# EAGLE design Stpr_driver_PCB (EAGLE 9.2.1)
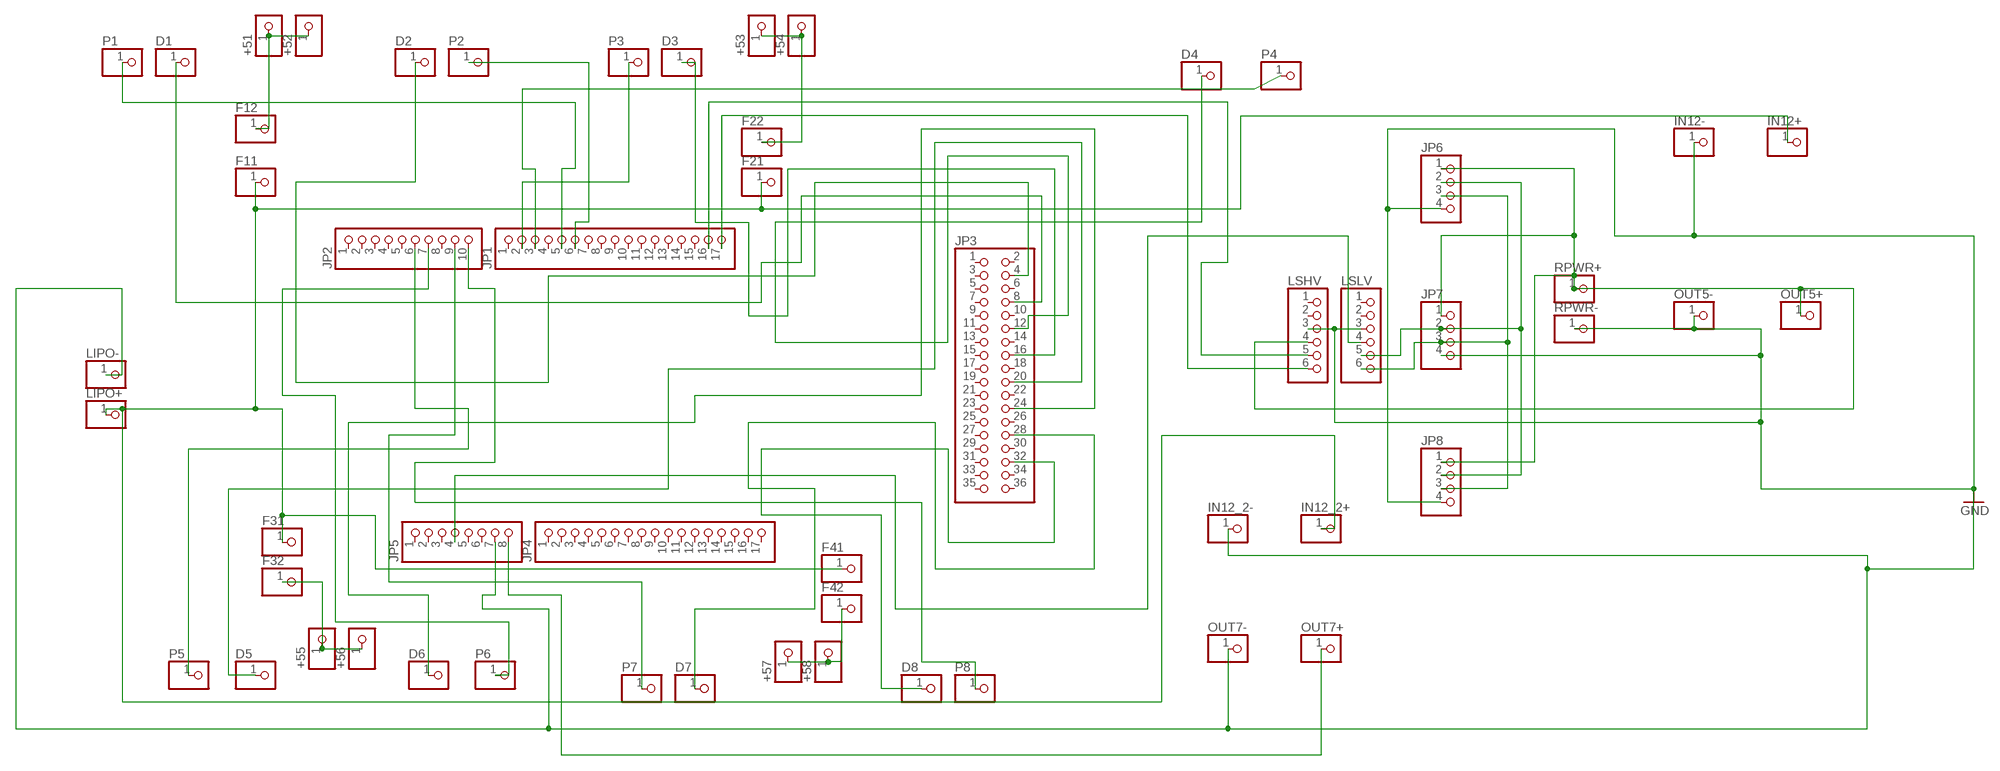
[diagram p0: schematic, sheet 1]

## Parts
+51  PINHD-1X1  [1X01]
+52  PINHD-1X1  [1X01]
+53  PINHD-1X1  [1X01]
+54  PINHD-1X1  [1X01]
+55  PINHD-1X1  [1X01]
+56  PINHD-1X1  [1X01]
+57  PINHD-1X1  [1X01]
+58  PINHD-1X1  [1X01]
D1  PINHD-1X1  [1X01]
D2  PINHD-1X1  [1X01]
D3  PINHD-1X1  [1X01]
D4  PINHD-1X1  [1X01]
D5  PINHD-1X1  [1X01]
D6  PINHD-1X1  [1X01]
D7  PINHD-1X1  [1X01]
D8  PINHD-1X1  [1X01]
F11  PINHD-1X1  [1X01]
F12  PINHD-1X1  [1X01]
F21  PINHD-1X1  [1X01]
F22  PINHD-1X1  [1X01]
F31  PINHD-1X1  [1X01]
F32  PINHD-1X1  [1X01]
F41  PINHD-1X1  [1X01]
F42  PINHD-1X1  [1X01]
IN12+  PINHD-1X1  [1X01]
IN12-  PINHD-1X1  [1X01]
IN12_2+  PINHD-1X1  [1X01]
IN12_2-  PINHD-1X1  [1X01]
JP1  PINHD-1X17  [1X17]
JP2  PINHD-1X10  [1X10]
JP3  PINHD-2X18  [2X18]
JP4  PINHD-1X17  [1X17]
JP5  PINHD-1X8  [1X08]
JP6  PINHD-1X4  [1X04]
JP7  PINHD-1X4  [1X04]
JP8  PINHD-1X4  [1X04]
LIPO+  PINHD-1X1  [1X01]
LIPO-  PINHD-1X1  [1X01]
LSHV  PINHD-1X6  [1X06]
LSLV  PINHD-1X6  [1X06]
OUT5+  PINHD-1X1  [1X01]
OUT5-  PINHD-1X1  [1X01]
OUT7+  PINHD-1X1  [1X01]
OUT7-  PINHD-1X1  [1X01]
P1  PINHD-1X1  [1X01]
P2  PINHD-1X1  [1X01]
P3  PINHD-1X1  [1X01]
P4  PINHD-1X1  [1X01]
P5  PINHD-1X1  [1X01]
P6  PINHD-1X1  [1X01]
P7  PINHD-1X1  [1X01]
P8  PINHD-1X1  [1X01]
RPWR+  PINHD-1X1  [1X01]
RPWR-  PINHD-1X1  [1X01]

## Nets
GND: IN12-.1 IN12_2-.1 JP5.7 JP6.4 JP7.4 JP8.4 LIPO-.1 LSHV.3 LSLV.3 OUT5-.1 OUT7-.1 RPWR-.1
N$1: F11.1 F21.1 F31.1 F41.1 IN12+.1 LIPO+.1
N$2: +55.1 +56.1 F32.1
N$3: +57.1 +58.1 F42.1
N$4: +51.1 +52.1 F12.1
N$5: +53.1 +54.1 F22.1
N$6: D3.1 JP3.16
N$7: IN12_2+.1
N$8: JP1.5 P1.1
N$9: JP6.1 JP7.1 JP8.1 LSHV.4 OUT5+.1 RPWR+.1
N$10: JP1.6 P2.1
N$11: JP1.2 P3.1
N$12: JP1.3 P4.1
N$13: JP2.6 P5.1
N$14: JP6.2 JP7.2 JP8.2 LSLV.5
N$15: JP2.9 P7.1
N$16: JP5.8 OUT7+.1
N$17: D1.1 JP3.8
N$18: D2.1 JP3.4
N$20: D4.1 JP3.12
N$21: JP2.10 P8.1
N$22: D5.1 JP3.20
N$23: D6.1 JP3.24
N$24: D7.1 JP3.28
N$25: D8.1 JP3.32
N$26: JP2.7 P6.1
N$27: JP6.3 JP7.3 JP8.3 LSLV.6
N$28: JP1.17 LSHV.6
N$29: JP1.16 LSHV.5
N$31: JP5.4 LSLV.4
Unconnected: JP1.1 JP1.4 JP1.7 JP1.8 JP1.9 JP1.10 JP1.11 JP1.12 JP1.13 JP1.14 JP1.15 JP2.1 JP2.2 JP2.3 JP2.4 JP2.5 JP2.8 JP3.1 JP3.2 JP3.3 JP3.5 JP3.6 JP3.7 JP3.9 JP3.10 JP3.11 JP3.13 JP3.14 JP3.15 JP3.17 JP3.18 JP3.19 JP3.21 JP3.22 JP3.23 JP3.25 JP3.26 JP3.27 JP3.29 JP3.30 JP3.31 JP3.33 JP3.34 JP3.35 JP3.36 JP4.1 JP4.2 JP4.3 JP4.4 JP4.5 JP4.6 JP4.7 JP4.8 JP4.9 JP4.10 JP4.11 JP4.12 JP4.13 JP4.14 JP4.15 JP4.16 JP4.17 JP5.1 JP5.2 JP5.3 JP5.5 JP5.6 LSHV.1 LSHV.2 LSLV.1 LSLV.2

## Library data of the parts
+51-+58 D1-D8 F11 F12 F21 F22 F31 F32 F41 F42 IN12+ IN12- IN12_2+ IN12_2- LIPO+ LIPO- OUT5+ OUT5- OUT7+ OUT7- P1-P8 RPWR+ RPWR- = pinhead:PINHD-1X1: PIN HEADER
JP1 JP4 = pinhead:PINHD-1X17: PIN HEADER
JP2 = pinhead:PINHD-1X10: PIN HEADER
JP3 = pinhead:PINHD-2X18: PIN HEADER
JP5 = pinhead:PINHD-1X8: PIN HEADER
JP6-JP8 = pinhead:PINHD-1X4: PIN HEADER
LSHV LSLV = pinhead:PINHD-1X6: PIN HEADER

## Board
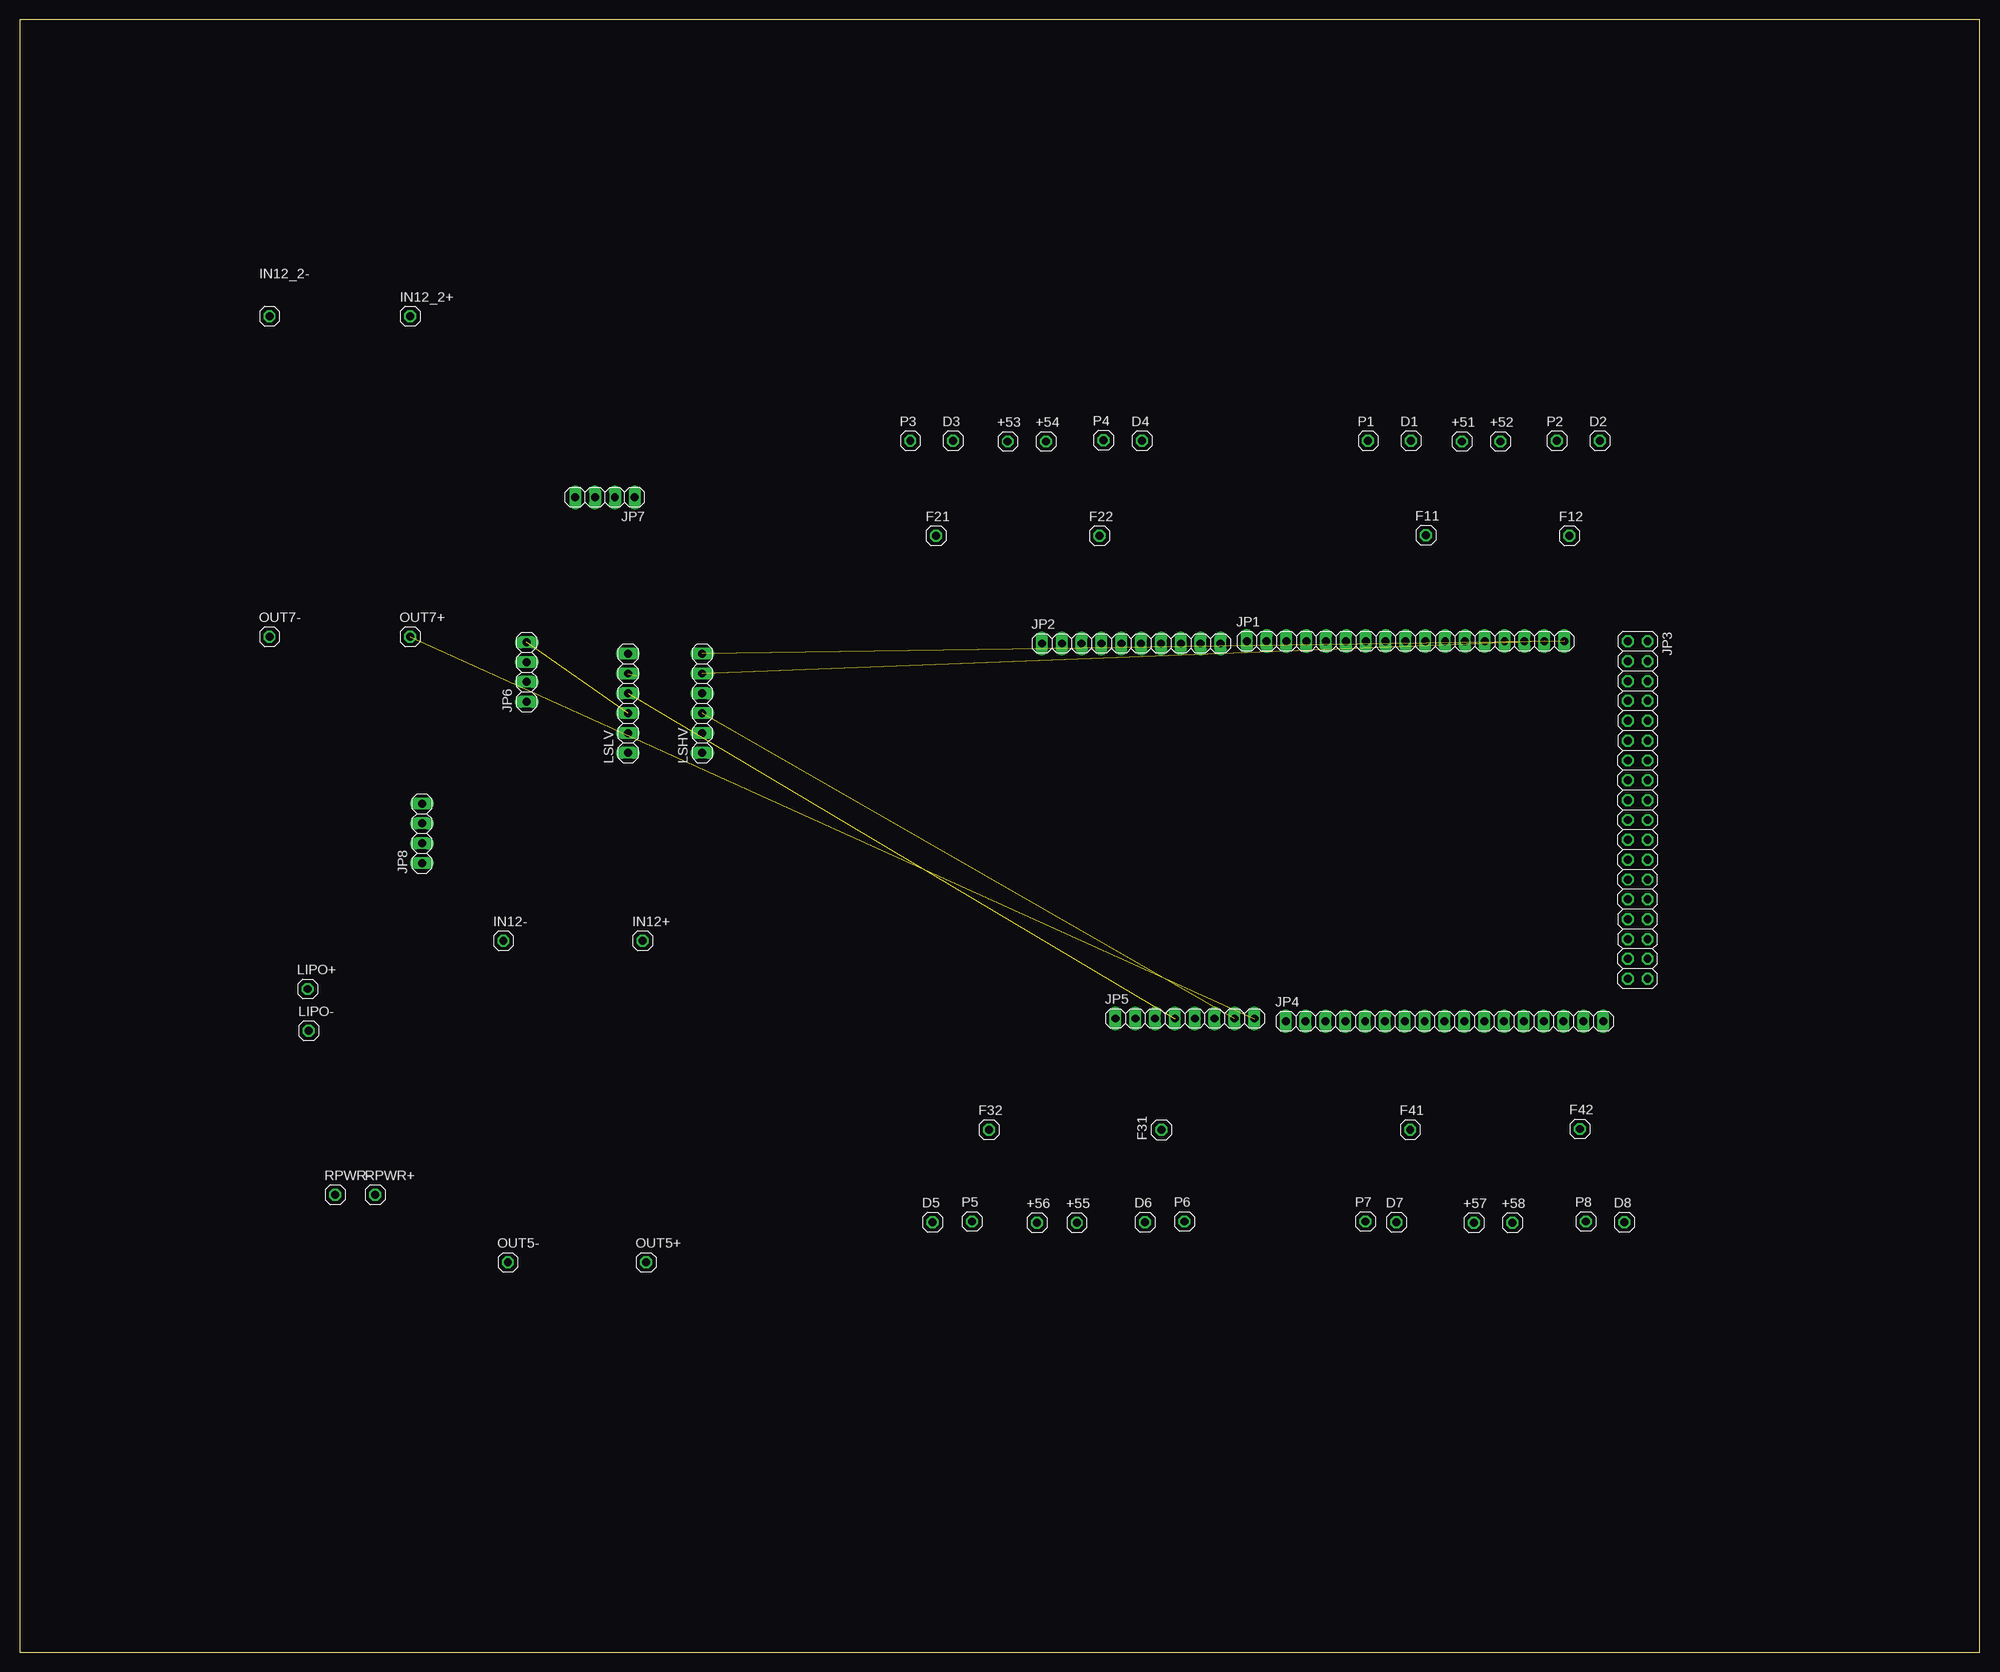
[diagram p1: board, top side]
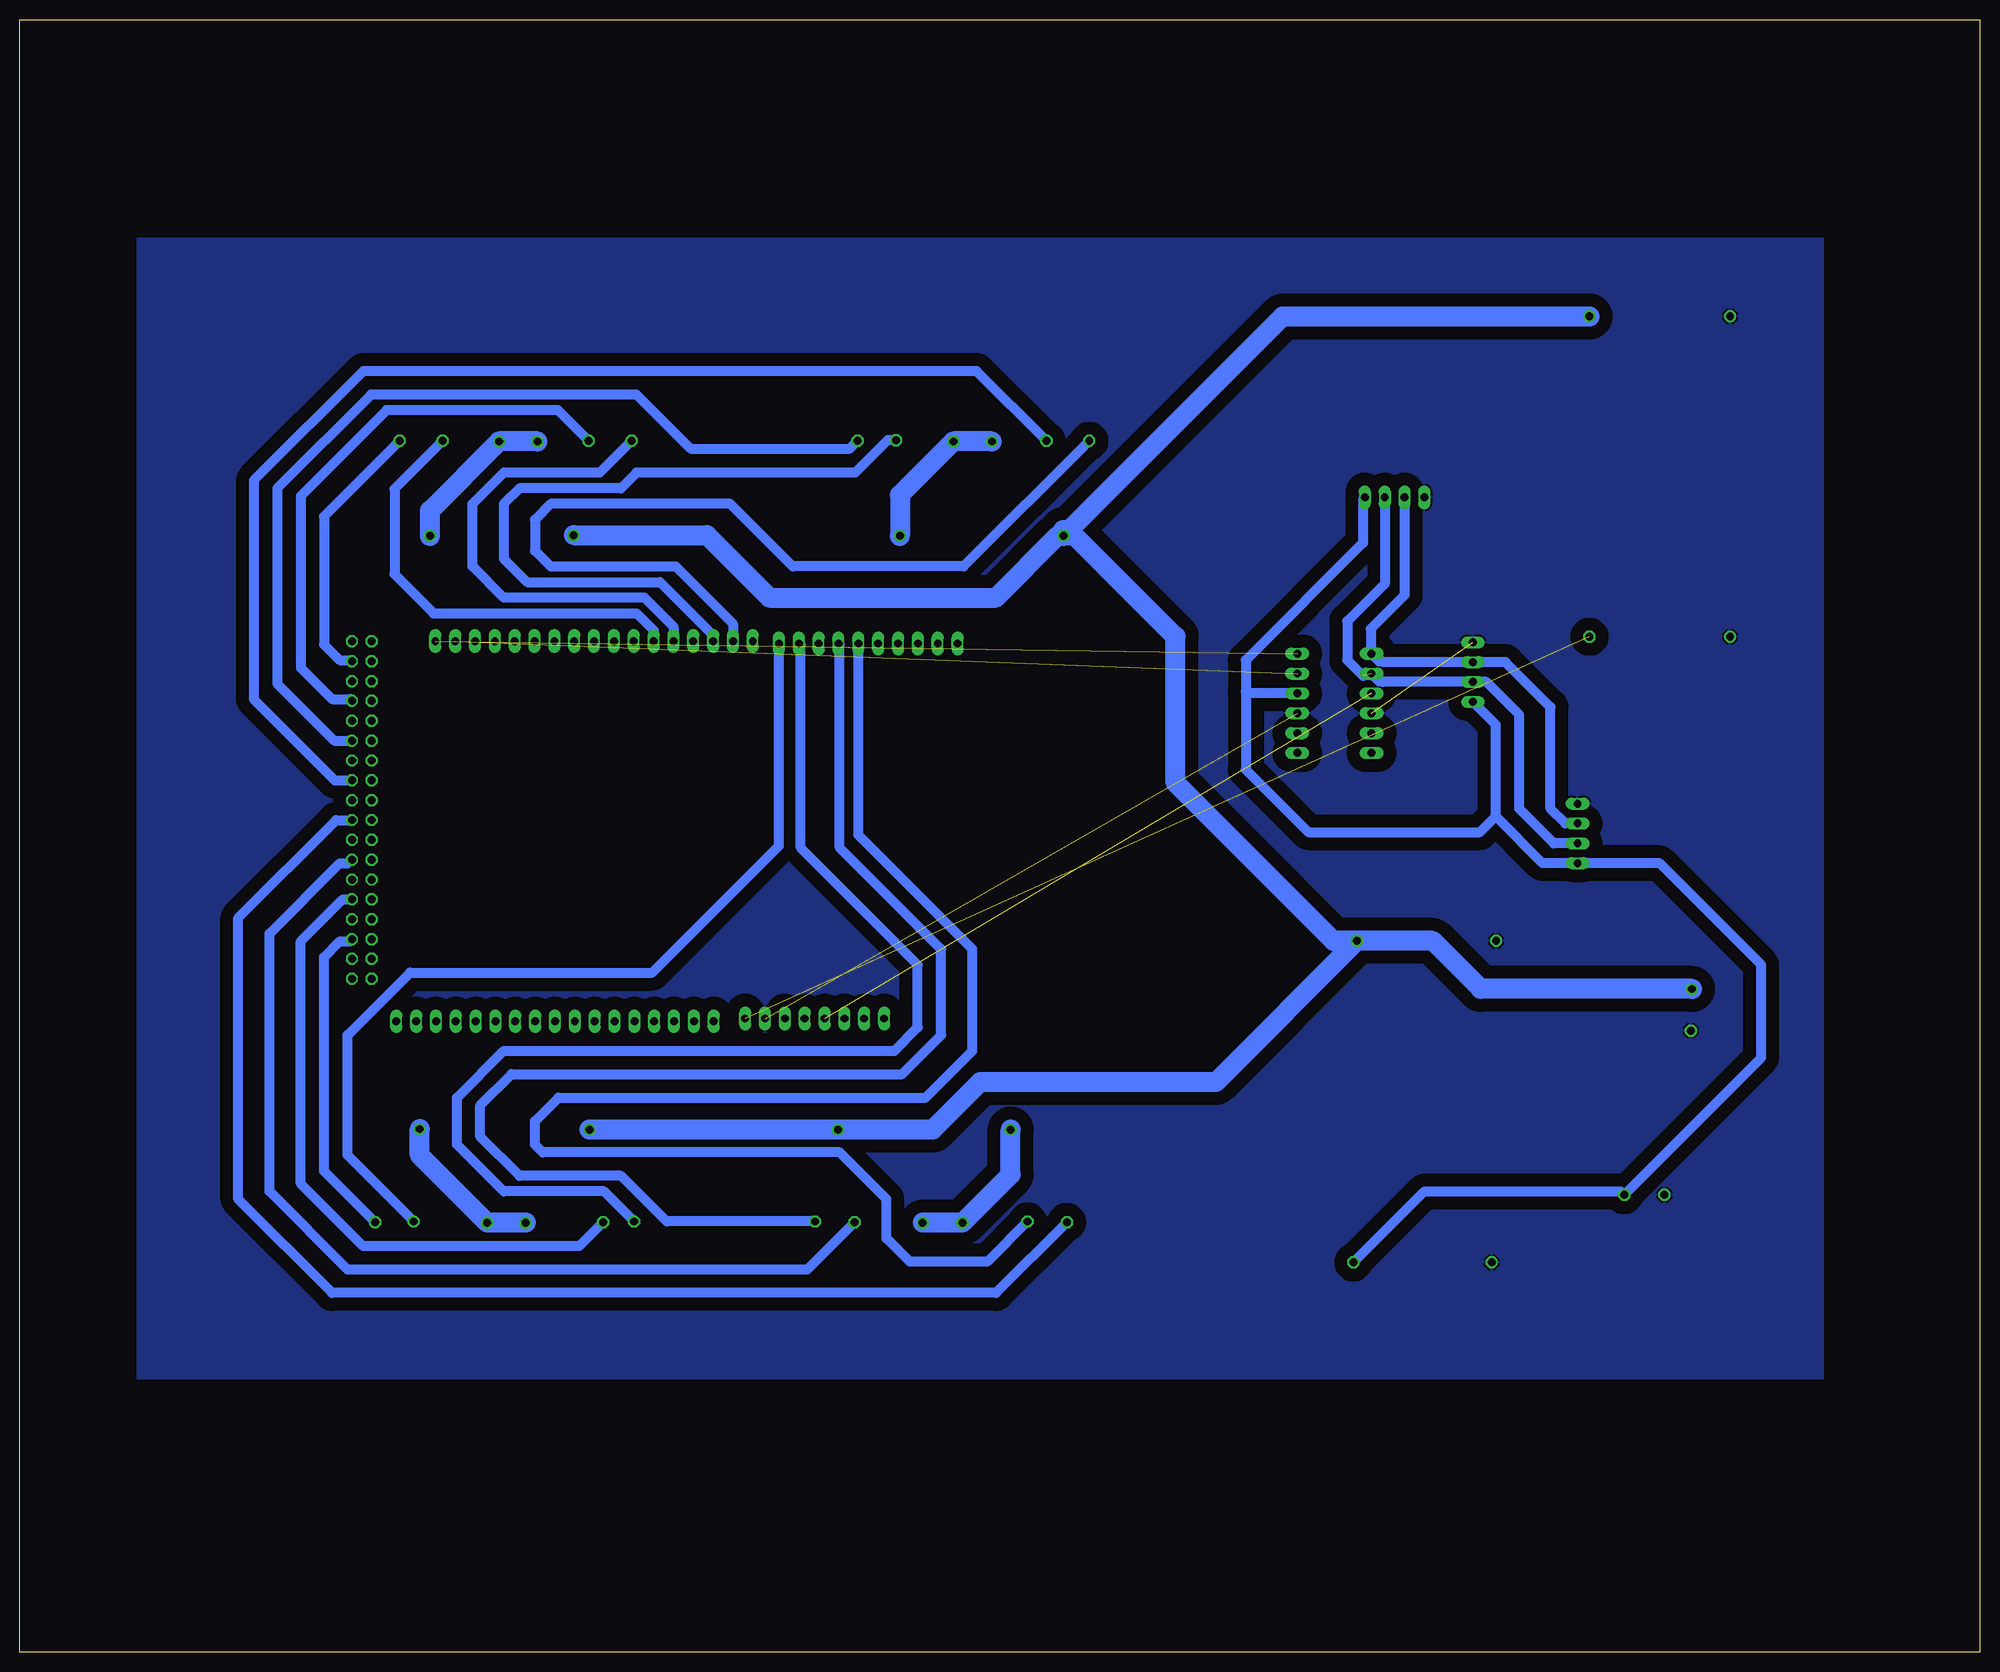
[diagram p2: board, bottom side, seen from below]

Size 251 x 209 mm. Coordinates in mm from the lower left corner, seen from the top.
Outline: 0,0 251,0 251,209 0,209 0,0
Copper layers (1*16): Top 0.035mm / dielectric 1.5mm / Bottom 0.035mm
Design rules "default": minimum track width 6mil, minimum drill 0.35mm, track to track 6mil, track to pad 6mil, pad to pad 6mil, via to via 6mil, smd to smd 6mil, copper to edge 40mil, drill to drill 6mil, minimum pad ring 10mil, minimum via ring 8mil, stop-mask expansion 4mil, vias tented up to drill 0mil, thermal gap 10mil

### Footprints (pad centres in the part's own frame; a part is rotated, then mirrored left to right if it is on the bottom)
1X01 = drill 1.016 octagon: 1 0,0
1X17 = drill 1.016 long: 1 -20.32,0; 2 -17.78,0; 3 -15.24,0; 4 -12.7,0; 5 -10.16,0; 6 -7.62,0; 7 -5.08,0; 8 -2.54,0; 9 0,0; 10 2.54,0; 11 5.08,0; 12 7.62,0; 13 10.16,0; 14 12.7,0; 15 15.24,0; 16 17.78,0; 17 20.32,0
1X10 = drill 1.016 long: 1 -11.43,0; 2 -8.89,0; 3 -6.35,0; 4 -3.81,0; 5 -1.27,0; 6 1.27,0; 7 3.81,0; 8 6.35,0; 9 8.89,0; 10 11.43,0
2X18 = drill 1.016 octagon: 1 -21.59,-1.27; 2 -21.59,1.27; 3 -19.05,-1.27; 4 -19.05,1.27; 5 -16.51,-1.27; 6 -16.51,1.27; 7 -13.97,-1.27; 8 -13.97,1.27; 9 -11.43,-1.27; 10 -11.43,1.27; 11 -8.89,-1.27; 12 -8.89,1.27; 13 -6.35,-1.27; 14 -6.35,1.27; 15 -3.81,-1.27; 16 -3.81,1.27; 17 -1.27,-1.27; 18 -1.27,1.27; 19 1.27,-1.27; 20 1.27,1.27; 21 3.81,-1.27; 22 3.81,1.27; 23 6.35,-1.27; 24 6.35,1.27; 25 8.89,-1.27; 26 8.89,1.27; 27 11.43,-1.27; 28 11.43,1.27; 29 13.97,-1.27; 30 13.97,1.27; 31 16.51,-1.27; 32 16.51,1.27; 33 19.05,-1.27; 34 19.05,1.27; 35 21.59,-1.27; 36 21.59,1.27
1X08 = drill 1.016 long: 1 -8.89,0; 2 -6.35,0; 3 -3.81,0; 4 -1.27,0; 5 1.27,0; 6 3.81,0; 7 6.35,0; 8 8.89,0
1X04 = drill 1.016 long: 1 -3.81,0; 2 -1.27,0; 3 1.27,0; 4 3.81,0
1X06 = drill 1.016 long: 1 -6.35,0; 2 -3.81,0; 3 -1.27,0; 4 1.27,0; 5 3.81,0; 6 6.35,0

### Placement (x,y rotation side)
+51  184.68,154.99 0 top
+52  189.6,154.99 0 top
+53  126.52,154.99 0 top
+54  131.44,154.99 0 top
+55  135.36,54.99 0 top
+56  130.28,54.99 0 top
+57  186.2,54.99 0 top
+58  191.12,54.99 0 top
D1  178.14,155.07 0 top
D2  202.33,155.07 0 top
D3  119.52,155.07 0 top
D4  143.71,155.07 0 top
D5  116.9,55.07 0 top
D6  144.09,55.07 0 top
D7  176.28,55.07 0 top
D8  205.47,55.07 0 top
F11  180.04,142.99 0 top
F12  198.44,142.91 0 top
F21  117.36,142.91 0 top
F22  138.28,142.91 0 top
F31  146.2,66.91 90 top
F32  124.12,66.91 0 top
F41  178.04,66.91 0 top
F42  199.76,66.99 0 top
IN12+  79.76,91.07 0 top
IN12-  61.95,91.07 0 top
IN12_2+  50,171 0 top
IN12_2-  32,171 0 top
JP1  177.44,129.43 0 top
JP2  142.33,129.13 0 top
JP3  207.17,107.81 270 top
JP4  182.44,80.78 0 top
JP5  149.2,81.13 0 top
JP6  64.93,125.48 90 top
JP7  74.95,147.83 180 top
JP8  51.52,104.83 90 top
LIPO+  36.87,84.91 0 top
LIPO-  37.04,79.56 0 top
LSHV  87.41,121.48 90 top
LSLV  77.9,121.48 90 top
OUT5+  80.22,49.91 0 top
OUT5-  62.52,49.91 0 top
OUT7+  50,130 0 top
OUT7-  32,130 0 top
P1  172.66,155.07 0 top
P2  196.85,155.07 0 top
P3  114.04,155.07 0 top
P4  138.76,155.15 0 top
P5  121.95,55.15 0 top
P6  149.14,55.15 0 top
P7  172.33,55.15 0 top
P8  200.52,55.15 0 top
RPWR+  45.55,58.56 0 top
RPWR-  40.39,58.56 0 top

### Tracks (layer width: path | path; a pad name or v marks a point on that pad's centre or on a via)
GND  (2 unrouted)
  pour Bottom (isolate 1.676): 20,181 236,181 236,35 20,35
N$1
  Bottom 2.54: F41.1 F31.1 134.09,66.91 128,73 97.83,73 IN12+.1 | F21.1 115.91,142.91 103,130 103,111.31 82.76,91.07 IN12+.1 | LIPO+.1 63.91,84.91 70.07,91.07 IN12+.1 | F11.1 162.99,142.99 155,135 126,135 118.09,142.91 F21.1 | 117.36,143.64 F21.1 | F21.1 89.27,171 50,171
N$2
  Bottom 2.54: +55.1 +56.1 124.12,61.15 F32.1
N$3
  Bottom 2.54: +57.1 +58.1 199.76,63.63 F42.1
N$4
  Bottom 2.54: +51.1 +52.1 198.44,146.15 F12.1
N$5
  Bottom 2.54: +53.1 +54.1 138.28,148.15 F22.1
N$6
  Bottom 1.27: D3.1 128.45,164 207,164 221,150 221,122 210.62,111.62 JP3.16
N$8
  Bottom 1.27: P1.1 176.73,151 189,151 193,147 193,139 189,135 171,135 167.28,131.28 JP1.5
N$9
  Bottom 1.27: 62,107 56.02,101.02 JP8.1 51.5,101 41,101 28,88 28,76.11 RPWR+.1 46,59 71.13,59 OUT5+.1 | 62,107 62,118.74 JP6.1 | JP7.1 79,147.59 79,142 94,127 94,123 | 94,123 94,113 86,105 64,105 62,107 | LSHV.4 93.75,122.75 94,123
N$10
  Bottom 1.27: P2.1 203,148.92 203,138 198,133 172,133 169.82,130.82 JP1.6
N$11
  Bottom 1.27: P3.1 130.11,139 152,139 160,147 183,147 185,145 185,141 183,139 167,139 159.66,131.66 JP1.2
N$12
  Bottom 1.27: P4.1 139.85,155.15 144,151 172,151 174,149 187,149 189,147 189,140 186,137 169,137 162.2,130.2 JP1.3
N$13
  Bottom 1.27: P5.1 127.1,50 137,50 140,53 140,58 146,64 184,64 185,65 185,68 182,71 135,71 129,77 129,90 143.6,104.6 JP2.6
N$14  (1 unrouted)
  Bottom 1.27: LSLV.5 76.91,124.3 76.5,124.3 76.41,124.21 JP6.2 63.21,124.21 59,120 59,108 54.56,103.56 JP8.2 | JP7.2 76.22,136.78 81,132 81,127 79,125
N$15
  Bottom 1.27: P7.1 176.18,59 189,59 195,65 195,71 189,77 139,77 136,80 136,88 151,103 151,128.91 JP2.9
N$16  (1 unrouted)
N$17
  Bottom 1.27: D1.1 182.07,159 204,159 215,148 215,147 215,126 211,122 208.66,122 JP3.8
N$18
  Bottom 1.27: D2.1 212,145.4 212,129 210,127 208.58,127 JP3.4
N$20
  Bottom 1.27: D4.1 144.71,154.07 165.07,154.07 172,161 206,161 218,149 218,124 210.7,116.7 JP3.12
N$21
  Bottom 1.27: P8.1 209,63.63 209,79 201,87 170,87 153.76,103.24 JP2.10
N$22
  Bottom 1.27: D5.1 125.97,46 211,46 223,58 223,94 210.46,106.54 JP3.20
N$23
  Bottom 1.27: D6.1 150.16,49 209,49 219,59 219,92 210,101 209,101 208.54,101.46 JP3.24
N$24
  Bottom 1.27: D7.1 179.35,52 207,52 215,60 215,91 209.62,96.38 JP3.28
N$25
  Bottom 1.27: D8.1 212,61.6 212,89 210,91 208.74,91 JP3.32
N$26
  Bottom 1.27: P6.1 168.15,55.15 174,61 187,61 192,66 192,70 188,74 138,74 133,79 133,90 146,103 146,128.99 JP2.7
N$27
  Bottom 1.27: JP8.3 53.1,106.1 55,108 55,121 60.75,126.75 JP6.3 76.41,126.75 76.5,126.84 76.91,126.84 LSLV.6 78,127.93 78,131 73.68,135.32 JP7.3
N$28  (1 unrouted)
N$29  (1 unrouted)
N$31  (1 unrouted)